# Altium schematic sheet mcu.SchDoc
size 431 x 279 mm; SheetNumber: 1; SheetTotal: 4
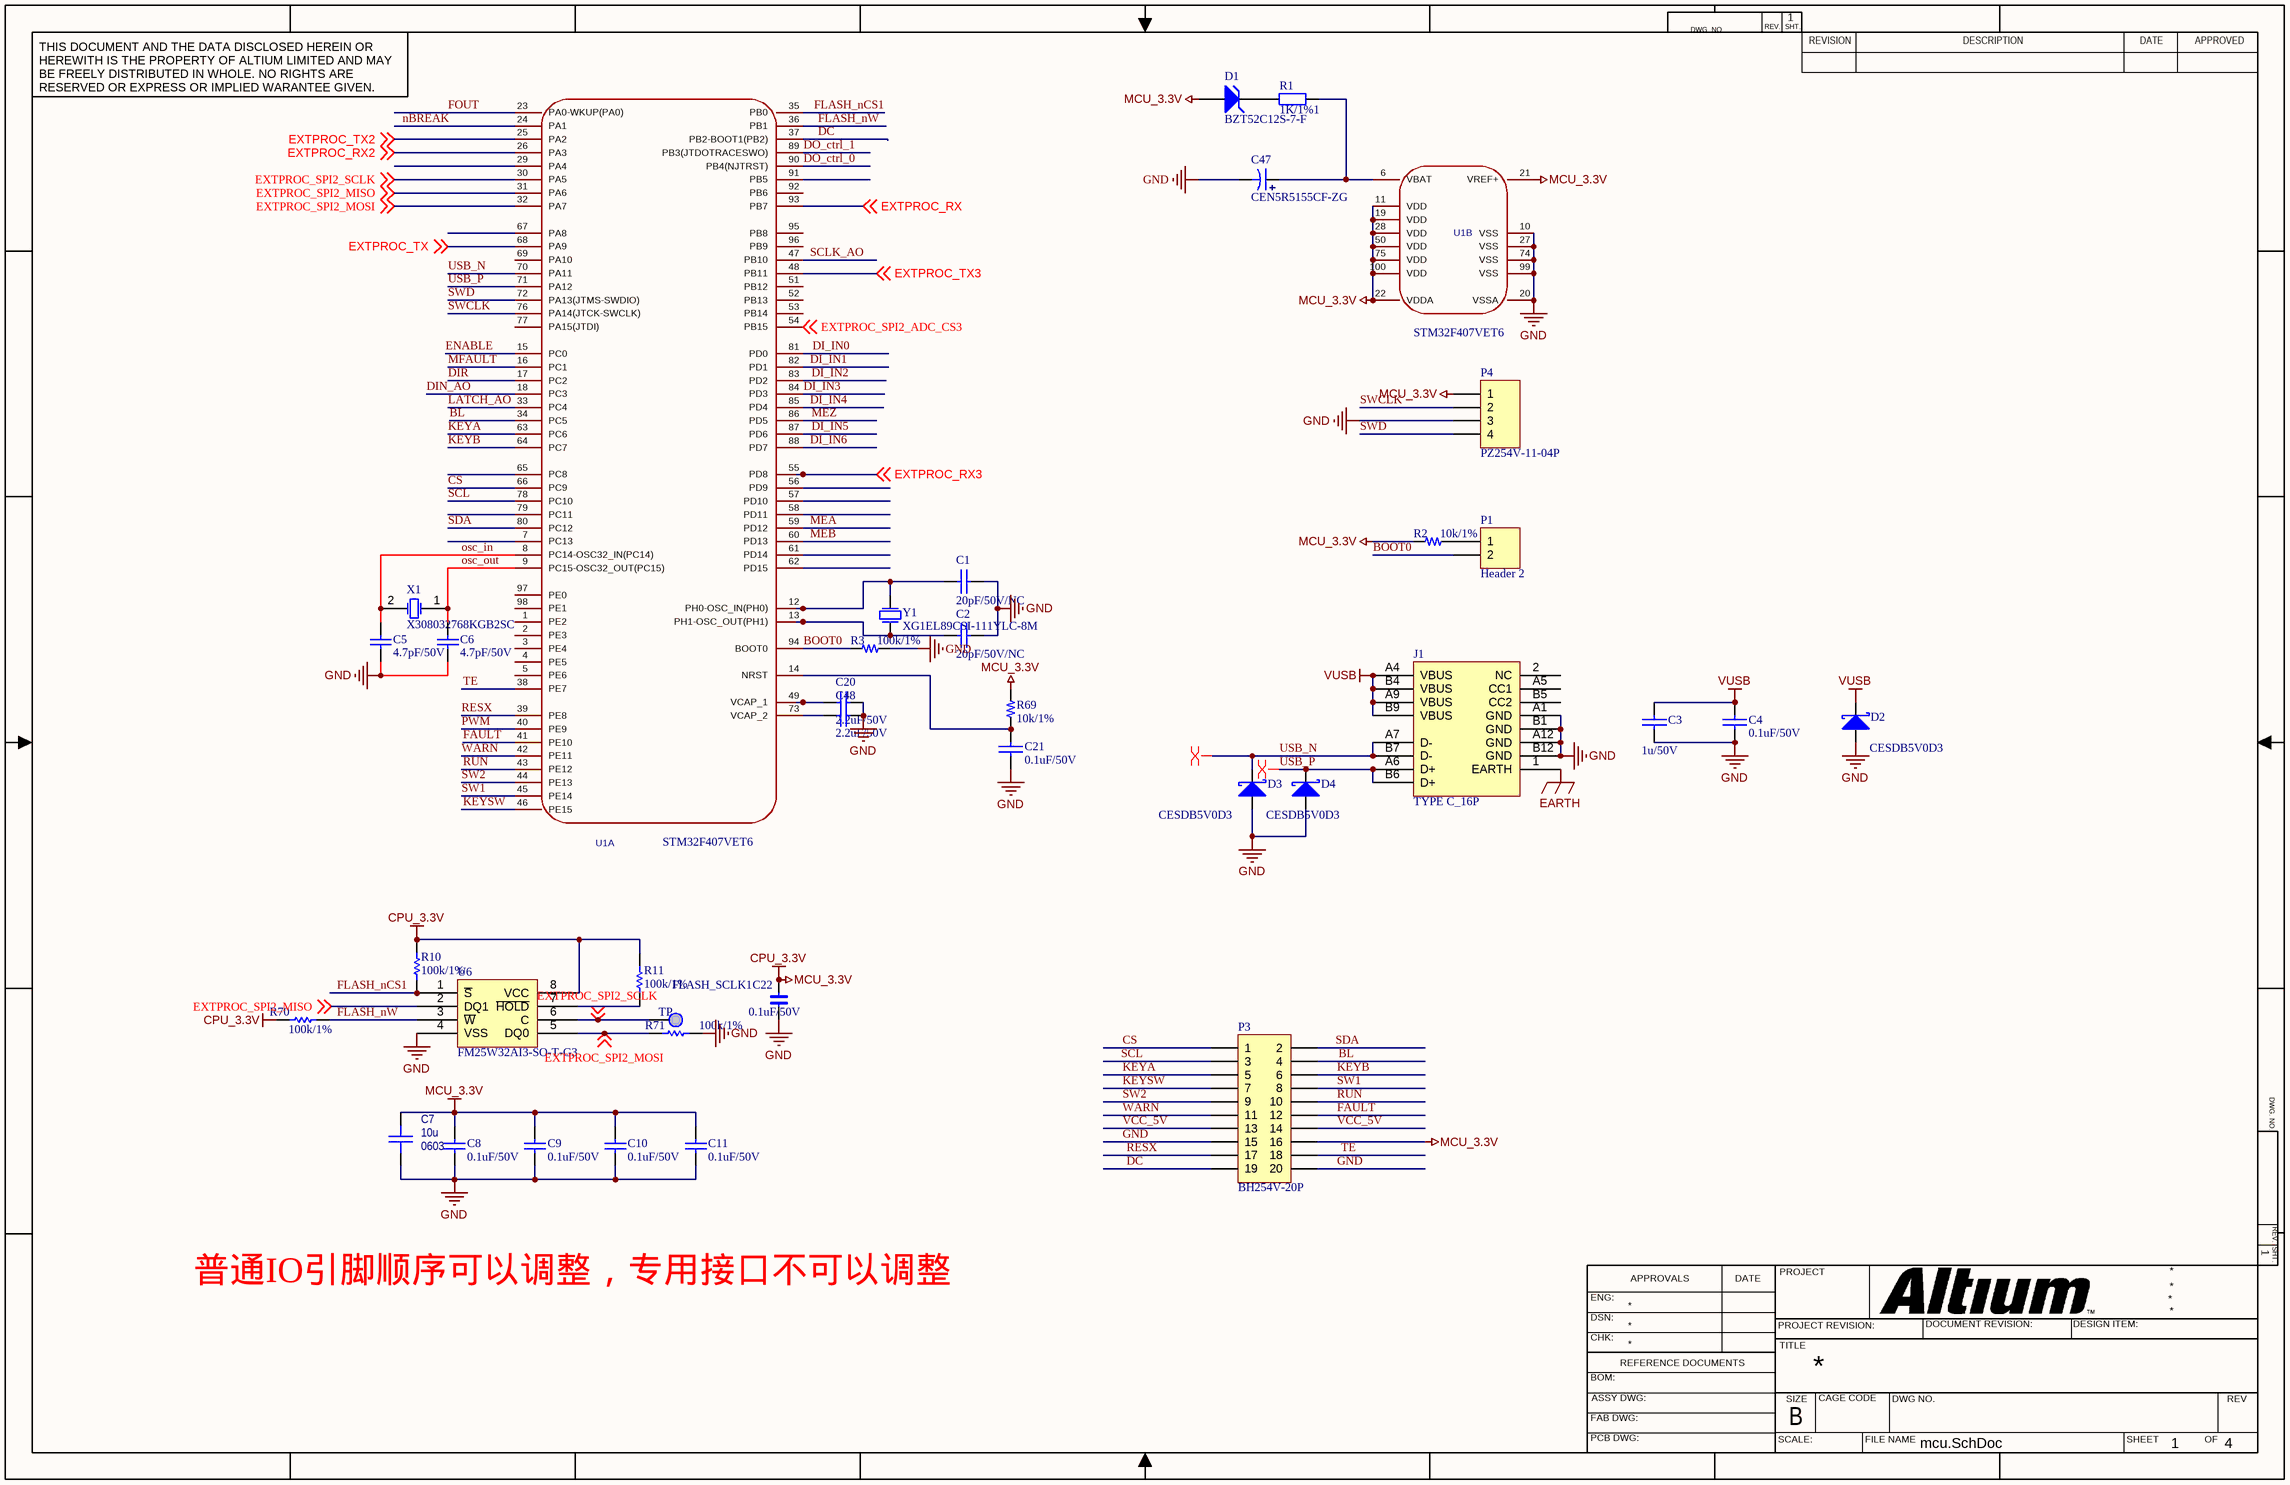
[diagram p0: mcu.SchDoc]

## Parts
C1  value 20pF/50V/NC  [0603C]  (hidden comment: 20pF/25V/NC)
C2  value 20pF/50V/NC  [0603C]  (hidden comment: 20pF/25V/NC)
C3  1u/50V  [0603C]
C4  0.1uF/50V  [0603C]
C5  4.7pF/50V  [0603C]
C6  4.7pF/50V  [0603C]
C7  value 10u  Package: 0603  [0603c]  (hidden comment: 10uF/16V)
C8  0.1uF/50V  [0603C]
C9  0.1uF/50V  [0603C]
C10  0.1uF/50V  [0603C]
C11  0.1uF/50V  [0603C]
C20  2.2uF/50V  [0603C]
C21  0.1uF/50V  [0603C]
C22  0.1uF/50V  [0603C]
C47  CEN5R5155CF-ZG  [CAP-TH_BD21.0-P5.00-D0.8_CENXXX-CF]
C48  2.2uF/50V  [0603C]
D1  BZT52C12S-7-F  [DIOD-SOD323-2_V]
D2  CESDB5V0D3  [SOD323]
D3  CESDB5V0D3  [SOD323]
D4  CESDB5V0D3  [SOD323]
FLASH_SCLK1  TP  [tpd]
J1  TYPE C_16P  [TYPEC_16P]
P1  Header 2  [HDR1X2]
P3  BH254V-20P  [IDC-TH_20P-L33.0-W13.8-H-M-R2-C10-P2.54-S2.54-TR]
P4  PZ254V-11-04P  [HDR1X4]
R1  1K/1%1  [0603R]  (no BOM)
R2  10k/1%  [0603R]
R3  100k/1%  [0603R]
R10  100k/1%  [0603R]
R11  100k/1%  [0603R]
R69  10k/1%  [0603R]
R70  100k/1%  [0603R]
R71  100k/1%  [0603R]
U1  STM32F407VET6  [TQFP-100]  (parts A,B of 2)
U6  FM25W32AI3-SO-T-G3  [SOIC127P790X216-8N]
X1  X308032768KGB2SC  [A]
Y1  XG1EL89CSI-111YLC-8M  [CRAY_5032]

## Nets
CPU_3.3V: C7.1 C8.2 C9.2 C10.2 C11.2 C22.2 D1.1(A) P3.16 P4.1 R2.1 R10.1 R11.1 R69.1 R70.1 U1.11(VDD) U1.19(VDD) U1.21(VREF+) U1.22(VDDA) U1.28(VDD) U1.50(VDD) U1.75(VDD) U1.100(VDD) U6.8(VCC)  [also labelled MCU_3.3V]
EARTH: J1.1(EARTH)
GND: C1.2 C2.2 C3.1 C4.1 C5.2 C6.2 C7.2 C8.1 C9.1 C10.1 C11.1 C20.1 C21.1 C22.1 C47.2 C48.1 D2.1(A) D3.1(A) D4.1(A) J1.A1(GND) J1.A12(GND) J1.B1(GND) J1.B12(GND) P3.15 P3.20 P4.3 R3.2 R71.2 U1.10(VSS) U1.20(VSSA) U1.27(VSS) U1.74(VSS) U1.99(VSS) U6.4(VSS)
VUSB: C3.2 C4.2 D2.2(K) J1.A4(VBUS) J1.A9(VBUS) J1.B4(VBUS) J1.B9(VBUS)
BL: P3.4 U1.34(PC5)
BOOT0: P1.2 R3.1 U1.94(BOOT0)
CS: P3.1 U1.66(PC9)
DC: P3.19 U1.37(PB2-BOOT1(PB2))
DI_IN0: U1.81(PD0)
DI_IN1: U1.82(PD1)
DI_IN2: U1.83(PD2)
DI_IN3: U1.84(PD3)
DI_IN4: U1.85(PD4)
DI_IN5: U1.87(PD6)
DI_IN6: U1.88(PD7)
DIN_AO: U1.18(PC3)
DIR: U1.17(PC2)
DO_ctrl_0: U1.90(PB4(NJTRST))
DO_ctrl_1: U1.89(PB3(JTDOTRACESWO))
ENABLE: U1.15(PC0)
EXTPROC_RX: U1.93(PB7) ; off-sheet EXTPROC_RX
EXTPROC_RX2: U1.26(PA3) ; off-sheet EXTPROC_RX2
EXTPROC_RX3: U1.55(PD8) ; off-sheet EXTPROC_RX3
EXTPROC_SPI2_ADC_CS3: U1.54(PB15) ; off-sheet EXTPROC_SPI2_ADC_CS3
EXTPROC_SPI2_MISO: U1.31(PA6) U6.2(DQ1) ; off-sheet EXTPROC_SPI2_MISO
EXTPROC_SPI2_MOSI: R71.1 U1.32(PA7) U6.5(DQ0) ; off-sheet EXTPROC_SPI2_MOSI
EXTPROC_SPI2_SCLK: FLASH_SCLK1.1 U1.30(PA5) U6.6(C) ; off-sheet EXTPROC_SPI2_SCLK
EXTPROC_TX: U1.68(PA9) ; off-sheet EXTPROC_TX
EXTPROC_TX2: U1.25(PA2) ; off-sheet EXTPROC_TX2
EXTPROC_TX3: U1.48(PB11) ; off-sheet EXTPROC_TX3
FAULT: P3.12 U1.41(PE10)
FLASH_nCS1: R10.2 U1.35(PB0) U6.1(~{S})
FLASH_nW: R70.2 U1.36(PB1) U6.3(~{W})
FOUT: U1.23(PA0-WKUP(PA0))
KEYA: P3.5 U1.63(PC6)
KEYB: P3.6 U1.64(PC7)
KEYSW: P3.7 U1.46(PE15)
LATCH_AO: U1.33(PC4)
MEA: U1.59(PD12)
MEB: U1.60(PD13)
MEZ: U1.86(PD5)
MFAULT: U1.16(PC1)
nBREAK: U1.24(PA1)
osc_in: C5.1 U1.8(PC14-OSC32_IN(PC14)) X1.2(OSC2)
osc_out: C6.1 U1.9(PC15-OSC32_OUT(PC15)) X1.1(OSC1)
PWM: U1.40(PE9)
RESX: P3.17 U1.39(PE8)
RUN: P3.10 U1.43(PE12)
SCL: P3.3 U1.78(PC10)
SCLK_AO: U1.47(PB10)
SDA: P3.2 U1.80(PC12)
SW1: P3.8 U1.45(PE14)
SW2: P3.9 U1.44(PE13)
SWCLK: P4.2 U1.76(PA14(JTCK-SWCLK))
SWD: P4.4 U1.72(PA13(JTMS-SWDIO))
TE: P3.18 U1.38(PE7)
USB_N: D3.2(K) J1.A7(D-) J1.B7(D-) U1.70(PA11)
USB_P: D4.2(K) J1.A6(D+) J1.B6(D+) U1.71(PA12)
VCC_5V: P3.13 P3.14
WARN: P3.11 U1.42(PE11)
NetC1_1: C1.1 U1.12(PH0-OSC_IN(PH0)) Y1.2(P2)
NetC2_1: C2.1 U1.13(PH1-OSC_OUT(PH1)) Y1.1(P1)
NetC20_2: C20.2 U1.49(VCAP_1)
NetC21_2: C21.2 R69.2 U1.14(NRST)
NetC47_1: C47.1 R1.2 U1.6(VBAT)
NetC48_2: C48.2 U1.73(VCAP_2)
NetD1_2: D1.2(K) R1.1
NetP1_1: P1.1 R2.2
NetR11_2: R11.2 U6.7(~{HOLD})

Not connected (* = marked no-connect by the designer): J1 2(NC) A5(CC1) B5(CC2); U1 1(PE2) 2(PE3) 3(PE4) 4(PE5) 5(PE6) 7(PC13) 29(PA4) 51(PB12) 52(PB13) 53(PB14) 56(PD9) 57(PD10) 58(PD11) 61(PD14) 62(PD15) 65(PC8) 67(PA8) 69(PA10) 77(PA15(JTDI)) 79(PC11) 91(PB5) 92(PB6) 95(PB8) 96(PB9) 97(PE0) 98(PE1)

## Layout directives
differential pair: USB_N, USB_P

## Notes on the sheet
- 普通IO引脚顺序可以调整，专用接口不可以调整
- DWG. NO.
- REV.
- SHT.
- THIS DOCUMENT AND THE DATA DISCLOSED HEREIN OR HEREWITH IS THE PROPERTY OF ALTIUM LIMITED AND MAY BE FREELY DISTRIBUTED IN WHOLE. NO RIGHTS ARE RESERVED OR EXPRESS OR IMPLIED WARANTEE GIVEN.
- REVISION
- DESCRIPTION
- DATE
- APPROVED
- ENG:
- APPROVALS
- PROJECT
- DSN:
- CHK:
- REFERENCE DOCUMENTS
- PROJECT REVISION:
- TITLE
- DOCUMENT REVISION:
- DESIGN ITEM:
- BOM:
- FAB DWG:
- PCB DWG:
- ASSY DWG:
- SCALE:
- SIZE
- B
- CAGE CODE
- FILE NAME
- DWG NO.
- SHEET
- OF
- REV

## Library data of the parts
C1-C4 C21 = CAP: Package: 0603
  C3: Value: 1u/50V
  C4 C21: Value: 0.1uF/50V
C5 = Cap: Capacitor; Value: 4.7pF; Package: 0603
C6 C8-C11 C20 C48 = Cap: Capacitor; Package: 0603
  C8-C11: Value: 0.1uF/50V
  C20 C48: Value: 2.2uF/50V
C7 = Capacitor_0603: Capacitor, MLCC; Voltage Rating: [voltage]
C22 = C: Package: 0603; Value: 0.1uF/50V
C47 = CAP2: 电解电容
D1 = BZT52C12S-7-F: Zener Current: 5mA; Vz - Zener Voltage: 12V; Zz - Zener Impedance: 40Ohms; Voltage Temperature Coefficient: 0.25mV/C; Voltage Tolerance: 5%; Width: 1.4mm; Value: BZT52C12S-7-F; Package: DIOD-SOD323-2_V
D2 D3 = DIODE S: Package: SOD323
D4 = DIODE S: Value: 0.1uF/50V; Package: SOD323
P3 = Header 10X2: Header, 10-Pin, Dual row; Package: IDC-TH_20P-L33.0-W13.8-H-M-R2-C10-P2.54-S2.54-TR
P4 = Header 4: Package: HDR1X4
R1 = Res0805M: Package: 0603
R2 R3 R69 = R: Package: 0603
  R2 R69: Value: 10k/1%
  R3: Value: 100k/1%
R10 R11 R70 R71 = Res1: Resistor; Package: 0603
U6 = M25P16-VMN6TPBA: Package: SOIC127P790X216-8N
X1 = XTAL: Crystal Oscillator; Package: A
Y1 = XTAL: Value: 8M; Package: CRAY_5032
FLASH_SCLK1 = TP: Package: tpd
J1 = TYPE C_16P: Package: TYPEC_16P
P1 = Header 2: Package: HDR1X2
U1 = STM32F407VET6: Package: TQFP-100